# EasyEDA Pro project OpenThermEth.eprj

# Schematic OpenThermEth
Board Name: OpenThermEth; Create Date: 2024-12-09; Page Name: OpenThermEth; Project Name: OpenThermEth; Schematic Name: OpenThermEth; Update Date: 2024-12-20; Company: EasyEDA.com; Drawn: EasyEDA; Page Size: A4; Part Number: JLCPCB-002; Reviewed: EasyEDA; Version: V0.1
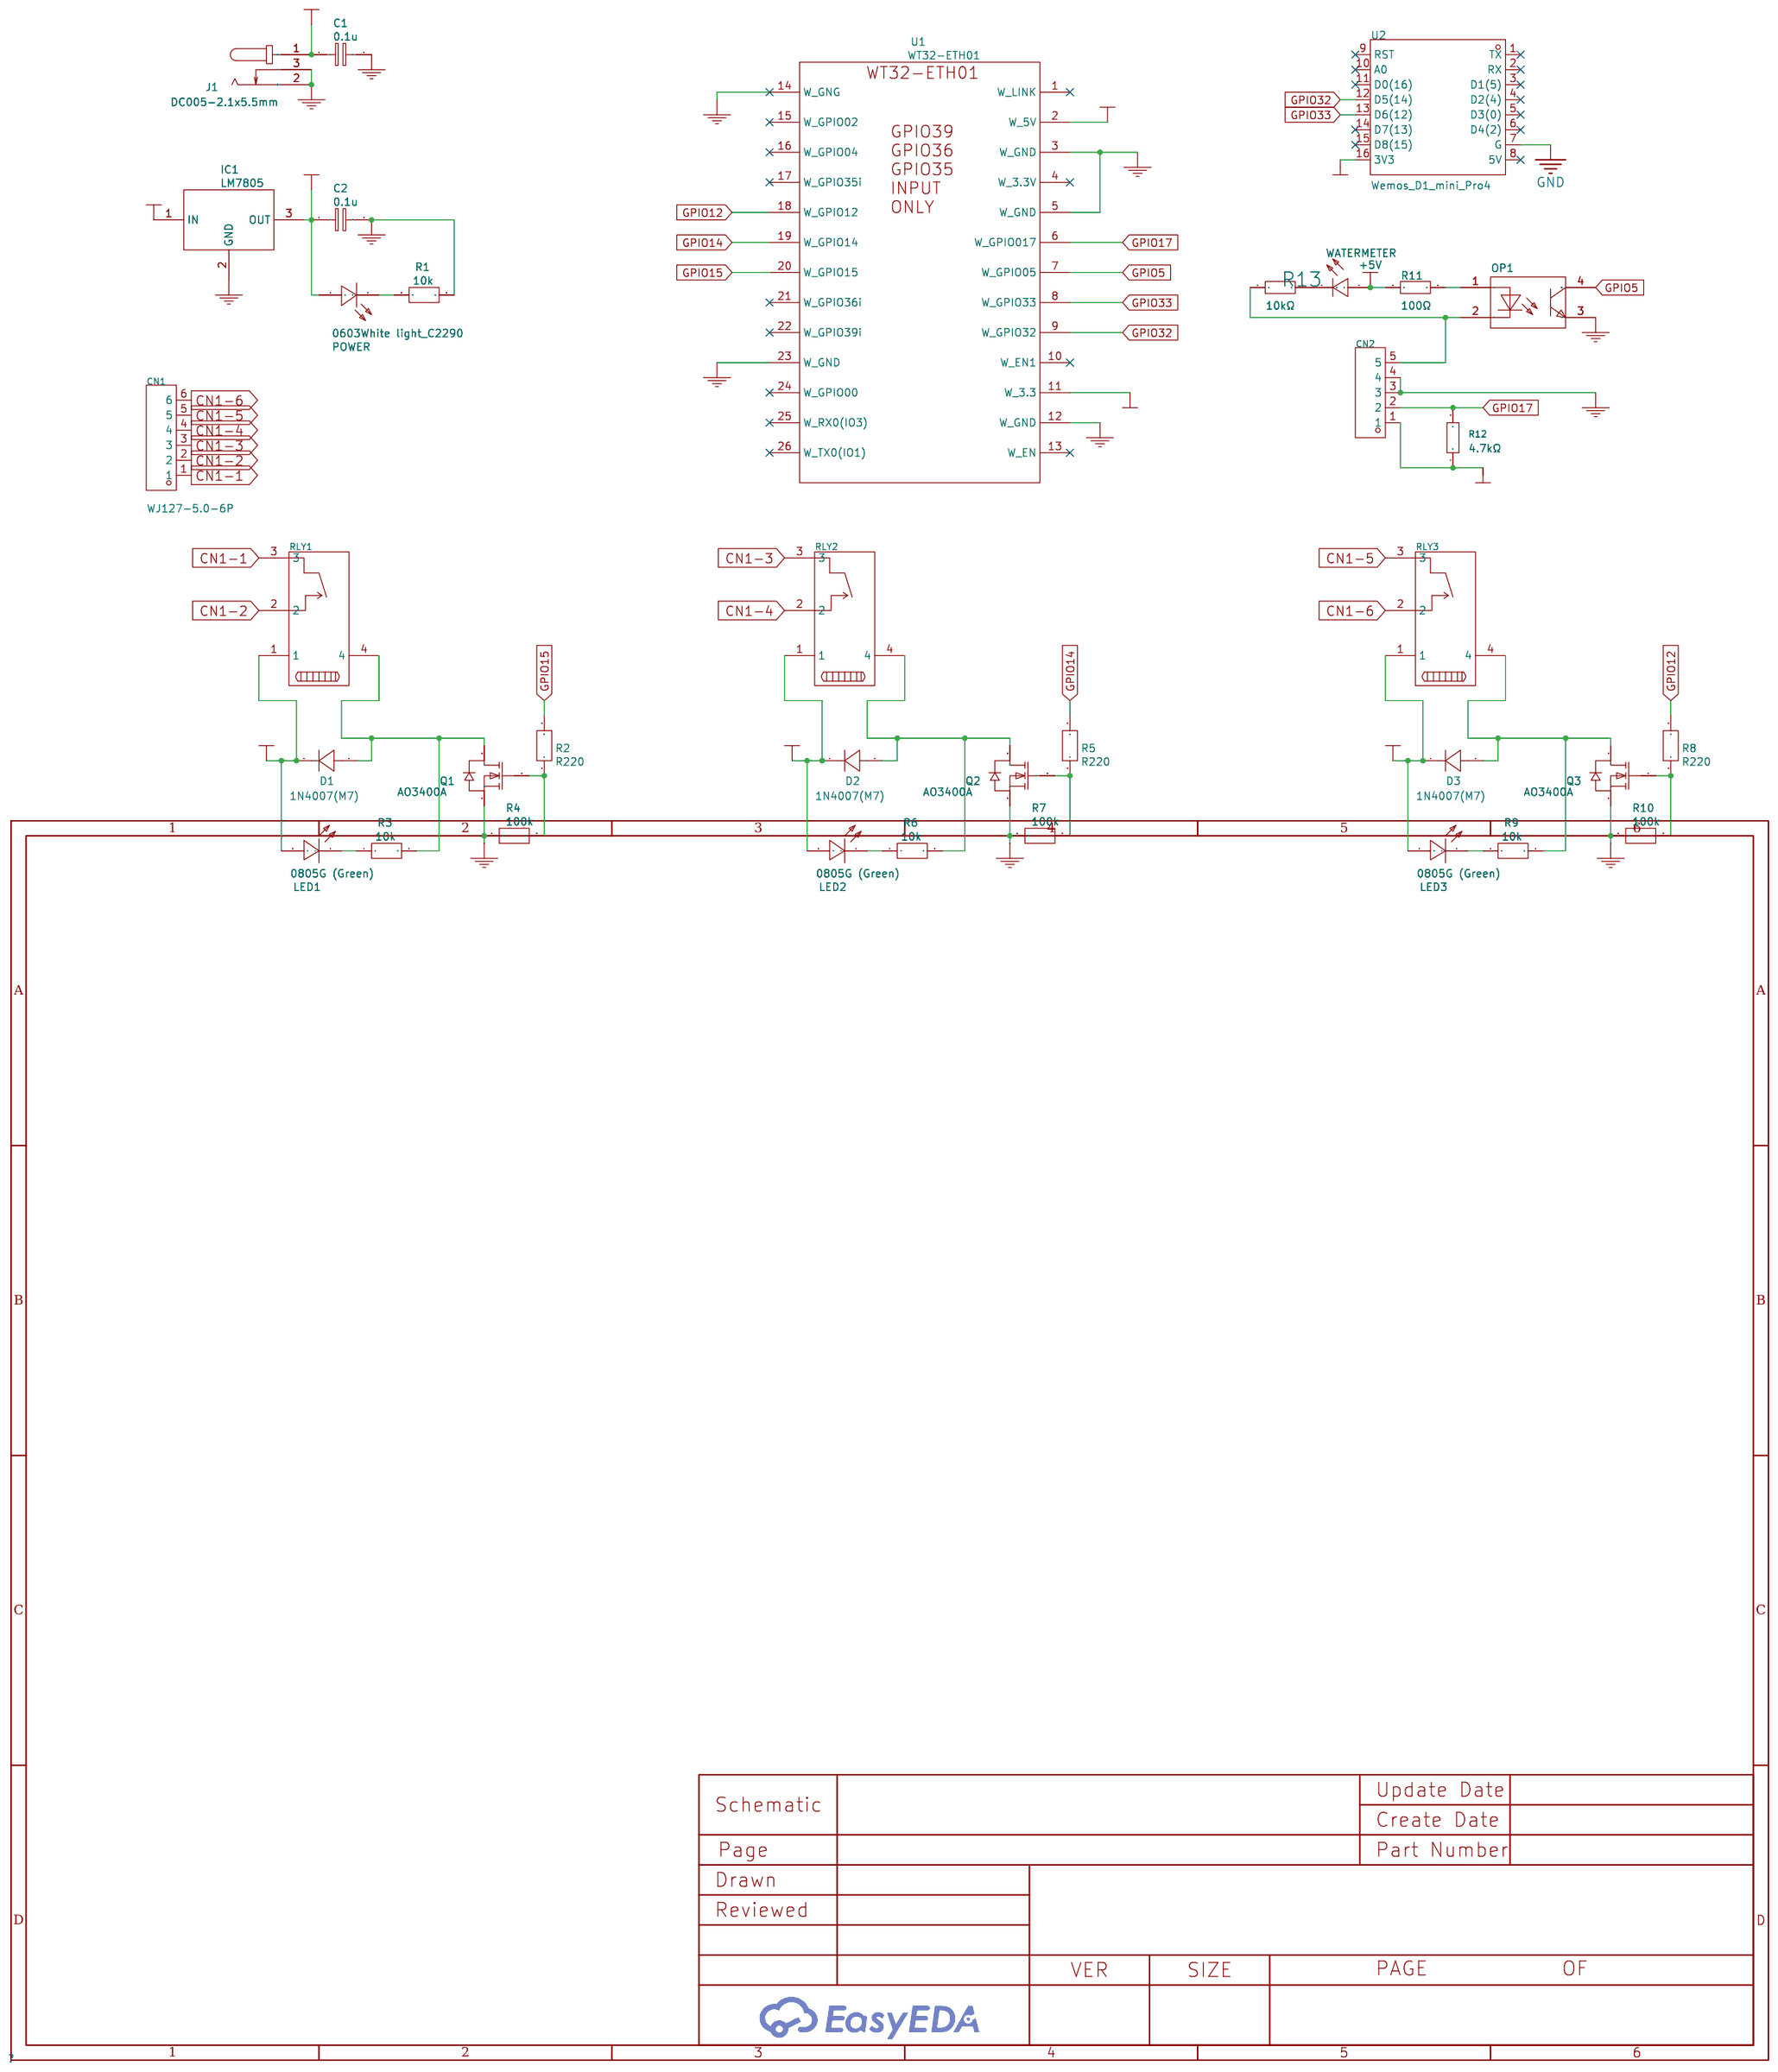
[diagram p0: schematic sheet]

## Parts
C1  0.1u  [C0603]
C2  0.1u  [C0603]
CN1  WJ127-5.0-6P  [CONN-TH_6P-P5.00_WJ127-5.0-6P]  (no BOM)
CN2  WJ127-5.0-5P  [CONN-TH_5P-P5.00_WJ127-5.0-5P]  (no BOM)
D1  1N4007(M7)  [SMA_L4.3-W2.7-LS5.1-RD]
D2  1N4007(M7)  [SMA_L4.3-W2.7-LS5.1-RD]
D3  1N4007(M7)  [SMA_L4.3-W2.7-LS5.1-RD]
IC1  LM7805  [LM7805]  (no BOM)
J1  DC005-2.1x5.5mm  [DC-IN-TH_POWER-JACK]  (no BOM)
LED1  0805G (Green)  [LED0805-RD_GREEN]
LED2  0805G (Green)  [LED0805-RD_GREEN]
LED3  0805G (Green)  [LED0805-RD_GREEN]
OP1  EL817S1(C)(TU)-F  [OPTO-SMD-4_L4.6-W6.5-P2.54-LS10.3-TL]
POWER  0603White light_C2290  [LED0603-R-RD_WHITE]
Q1  AO3400A  [SOT-23-3_L2.9-W1.6-P1.90-LS2.8-BR]
Q2  AO3400A  [SOT-23-3_L2.9-W1.6-P1.90-LS2.8-BR]
Q3  AO3400A  [SOT-23-3_L2.9-W1.6-P1.90-LS2.8-BR]
R1  10k  [R0603]
R2  R220  [R0603]
R3  10k  [R0603]
R4  100k  [R0603]
R5  R220  [R0603]
R6  10k  [R0603]
R7  100k  [R0603]
R8  R220  [R0603]
R9  10k  [R0603]
R10  100k  [R0603]
R11  100Ω  [R0805]
R12  4.7kΩ  [R0805]
R13  10kΩ  [R0603]
RLY1  G5NB-1A-E-DC5V  [RELAY-TH_G5NB-1A-E-DCXX]  (no BOM)
RLY2  G5NB-1A-E-DC5V  [RELAY-TH_G5NB-1A-E-DCXX]  (no BOM)
RLY3  G5NB-1A-E-DC5V  [RELAY-TH_G5NB-1A-E-DCXX]  (no BOM)
U1  WT32-ETH01  [WT32-ETH01-M]  (no BOM)
U2  Wemos_D1_mini_Pro4  [DIP-16_WEMOS_D1_MINI_PRO4]  (no BOM)
WATERMETER  19-213/Y2C-CQ2R2L/3T(CY)  [LED0603-RD-YELLOW]

## Library data of the parts
C1 C2 = 0.1u: Supplier Part: C1525; Supplier: LCSC; Manufacturer Part: CL05B104KO5NNNC; Manufacturer: SAMSUNG(三星)
CN1 = WJ127-5.0-6P: LCSC Part Name: 5mm 1x6P 排数:1 每排P数:6 直插; Supplier Part: C192781; Manufacturer: KANGNEX(康奈克斯电气); Supplier Footprint: 插件,P=5mm; JLCPCB Part Class: Extended Part; Datasheet: https://atta.szlcsc.com/upload/public/pdf/source/20191225/C192781_B56A6C480C3F3CBA75DCAA22912D9BEF.pdf; Supplier: LCSC; Structure: 1x6P; Pitch: 5mm; Color: Green; Mounting Style: Straight; Current Rating (Max): 15A; Voltage Rating (Max): 250V; Number of Pins: 6P; Number of Rows: 1; Wire Gauge - AWG: 14~26; Wire Gauge - mm2: 1.5; Number of PINs Per Row: 6; Operating Temperature Range: -40℃~+105℃
CN2 = WJ127-5.0-5P_C192780: LCSC Part Name: 5mm 1x5P 排数:1 每排P数:5 直插; Supplier Part: C192780; Manufacturer: KANGNEX(康奈克斯电气); Supplier Footprint: 插件,P=5mm; JLCPCB Part Class: Extended Part; Datasheet: https://atta.szlcsc.com/upload/public/pdf/source/20191225/C192780_FD0BDD0A5D81BC1DDFC4E04964283CC7.pdf; Supplier: LCSC; Structure: 1x5P; Pitch: 5mm; Color: Green; Mounting Style: Straight; Current Rating (Max): 15A; Voltage Rating (Max): 250V; Number of Pins: 5P; Number of Rows: 1; Wire Gauge - AWG: 14~26; Wire Gauge - mm2: 1.5; Number of PINs Per Row: 5; Operating Temperature Range: -40℃~+105℃
D1-D3 = 1N4007(M7): Supplier: LCSC; Supplier Part: C2988638; Manufacturer: UMW(友台半导体); JLCPCB Part Class: Extended Part
IC1 = LM7805: sim: true
J1 = DC005-2.1x5.5mm: Supplier: LCSC; Supplier Part: C9900001795; Manufacturer: 索峰; Manufacturer Part: POWER-JACK; JLCPCB Part Class: Extended Part
LED1-LED3 = 0805G (Green): Supplier: LCSC; Manufacturer: KENTO; Supplier Part: C2297; JLCPCB Part Class: Basic Part
OP1 = EL817S1(C)(TU)-F: Supplier: LCSC; Manufacturer: EVERLIGHT(亿光); Supplier Part: C106900; JLCPCB Part Class: Basic Part
POWER = 0603White light_C2290: Supplier: LCSC; Manufacturer: KENTO; Manufacturer Part: KT-0603W; Supplier Part: C2290; JLCPCB Part Class: Basic Part
Q1-Q3 = AO3400A: Supplier: LCSC; Manufacturer: AOS; Supplier Part: C20917; JLCPCB Part Class: Basic Part
R1 R3 R6 R9 = 10k: Supplier Part: C25804; Supplier: LCSC; Manufacturer Part: 0603WAF1002T5E; Manufacturer: UNI-ROYAL(厚声)
R2 R5 R8 = R220: Supplier Part: C22962; Supplier: LCSC; Manufacturer Part: 0603WAF2200T5E; Manufacturer: UNI-ROYAL(厚声)
R4 R7 R10 = 100k: Supplier Part: C25803; Supplier: LCSC; Manufacturer Part: 0603WAF1003T5E; Manufacturer: UNI-ROYAL(厚声)
R11 = 0805W8F1000T5E_C17408: LCSC Part Name: 100Ω ±1% 125mW 厚膜电阻; Supplier Part: C17408; Manufacturer: UNI-ROYAL(厚声); Manufacturer Part: 0805W8F1000T5E; Supplier Footprint: 0805; JLCPCB Part Class: Basic Part; Datasheet: https://atta.szlcsc.com/upload/public/pdf/source/20200306/C422600_1E6D84923E4A46A82E41ADD87F860B5C.pdf; Supplier: LCSC; Type: Thick Film Resistors; Tolerance: ±1%; Temperature Coefficient: ±100ppm/℃; Operating Temperature Range: -55℃~+155℃
R12 = 0805W8F4701T5E: LCSC Part Name: 4.7kΩ ±1% 125mW 厚膜电阻; Supplier Part: C17673; Manufacturer: UNI-ROYAL(厚声); Supplier Footprint: 0805; JLCPCB Part Class: Basic Part; Datasheet: https://atta.szlcsc.com/upload/public/pdf/source/20200306/C422600_1E6D84923E4A46A82E41ADD87F860B5C.pdf; Supplier: LCSC; Type: Thick Film Resistors; Tolerance: ±1%; Temperature Coefficient: ±100ppm/℃; Operating Temperature Range: -55℃~+155℃
R13 = 0603WAF1002T5E: LCSC Part Name: 厚膜电阻 10kΩ ±1% 100mW; Supplier Part: C25804; Manufacturer: UNI-ROYAL(厚声); Supplier Footprint: 0603; JLCPCB Part Class: Basic Part; Datasheet: https://atta.szlcsc.com/upload/public/pdf/source/20200306/C422600_1E6D84923E4A46A82E41ADD87F860B5C.pdf; Supplier: LCSC; Type: Thick Film Resistors; Tolerance: ±1%; Temperature Coefficient: ±100ppm/℃; Operating Temperature Range: -55℃~+155℃
RLY1-RLY3 = G5NB-1A-E-DC5V: Supplier Part: C48746; Manufacturer: OMRON(欧姆龙); Supplier Footprint: 插件,7x20.4mm; JLCPCB Part Class: Extended Part; Supplier: LCSC
U1 = WT32-ETH01: Manufacturer: Wireless-Tag; link: http://www.wireless-tag.com/wp-content/uploads/2020/08/WT32-ETH01规格书V1.2EN（英文）.pdf
U2 = Wemos_D1_mini_Pro4: Supplier Part: C2837266; Supplier Footprint: DIP-16; Supplier: LCSC
WATERMETER = 19-213/Y2C-CQ2R2L/3T(CY): LCSC Part Name: 黄灯; Supplier Part: C72038; Manufacturer: EVERLIGHT(亿光); Supplier Footprint: 0603; JLCPCB Part Class: Basic Part; Datasheet: https://atta.szlcsc.com/upload/public/pdf/source/20160507/1462613613586.pdf; Supplier: LCSC; Emitted Color: Yellow; Power Dissipation: 60mW; Forward Current: 20mA; Dominant Wavelength: 585.5nm~591.5nm; Peak Wavelength: 591nm; Lens Color: 无色透明透镜; Viewing Angle: 120°; Operating Temperature: -40℃~+85℃

## Nets
+3.3V: CN2.1 R12.1 U1.11(W_3.3) U2.16(3V3)
+5V: C2.1 D1.1(K) D2.1(K) D3.1(K) IC1.3(OUT) LED1.2(A) LED2.2(A) LED3.2(A) POWER.1(A) R11.1 RLY1.1 RLY2.1 RLY3.1 U1.2(W_5V) WATERMETER.2(A)
GND: C1.2 C2.2 CN2.3 CN2.4 IC1.2(GND) J1.2(GND) J1.3 OP1.3(EM) Q1.2(S) Q2.2(S) Q3.2(S) R1.2 R4.1 R7.1 R10.1 U1.3(W_GND) U1.5(W_GND) U1.12(W_GND) U1.14(W_GNG) U1.23(W_GND) U2.7(G)
VCC: C1.1 IC1.1(IN) J1.1(VCC)
CN1-1: CN1.1 RLY1.3
CN1-2: CN1.2 RLY1.2
CN1-3: CN1.3 RLY2.3
CN1-4: CN1.4 RLY2.2
CN1-5: CN1.5 RLY3.3
CN1-6: CN1.6 RLY3.2
GPIO5: OP1.4(COL) U1.7(W_GPIO05)
GPIO12: R8.2 U1.18(W_GPIO12)
GPIO14: R5.2 U1.19(W_GPIO14)
GPIO15: R2.2 U1.20(W_GPIO15)
GPIO17: CN2.2 R12.2 U1.6(W_GPIO017)
GPIO32: U1.9(W_GPIO32) U2.12(D5(14))
GPIO33: U1.8(W_GPIO33) U2.13(D6(12))
$1N3: D1.2(A) Q1.3(D) R3.2 RLY1.4
$1N5: Q1.1(G) R2.1 R4.2
$1N15: LED1.1(K) R3.1
$1N16: POWER.2(K) R1.1
$1N14239: D2.2(A) Q2.3(D) R6.2 RLY2.4
$1N14251: LED2.1(K) R6.1
$1N14257: Q2.1(G) R5.1 R7.2
$1N14805: D3.2(A) Q3.3(D) R9.2 RLY3.4
$1N14817: LED3.1(K) R9.1
$1N14823: Q3.1(G) R8.1 R10.2
$1N15278: OP1.1(AN) R11.2
$1N15297: CN2.5 OP1.2(CAT) R13.1
Net-(R13-2): R13.2 WATERMETER.1(C)

Not connected (* = marked no-connect by the designer): U1 1(W_LINK)* 4(W_3.3V)* 10(W_EN1)* 13(W_EN)* 15(W_GPIO02)* 16(W_GPIO04)* 17(W_GPIO35i)* 21(W_GPIO36i)* 22(W_GPIO39i)* 24(W_GPIO00)* 25(W_RX0(IO3))* 26(W_TX0(IO1))*; U2 1(TX)* 2(RX)* 3(D1(5))* 4(D2(4))* 5(D3(0))* 6(D4(2))* 8(5V)* 9(RST)* 10(A0)* 11(D0(16))* 14(D7(13))* 15(D8(15))*

# Board OpenThermEth
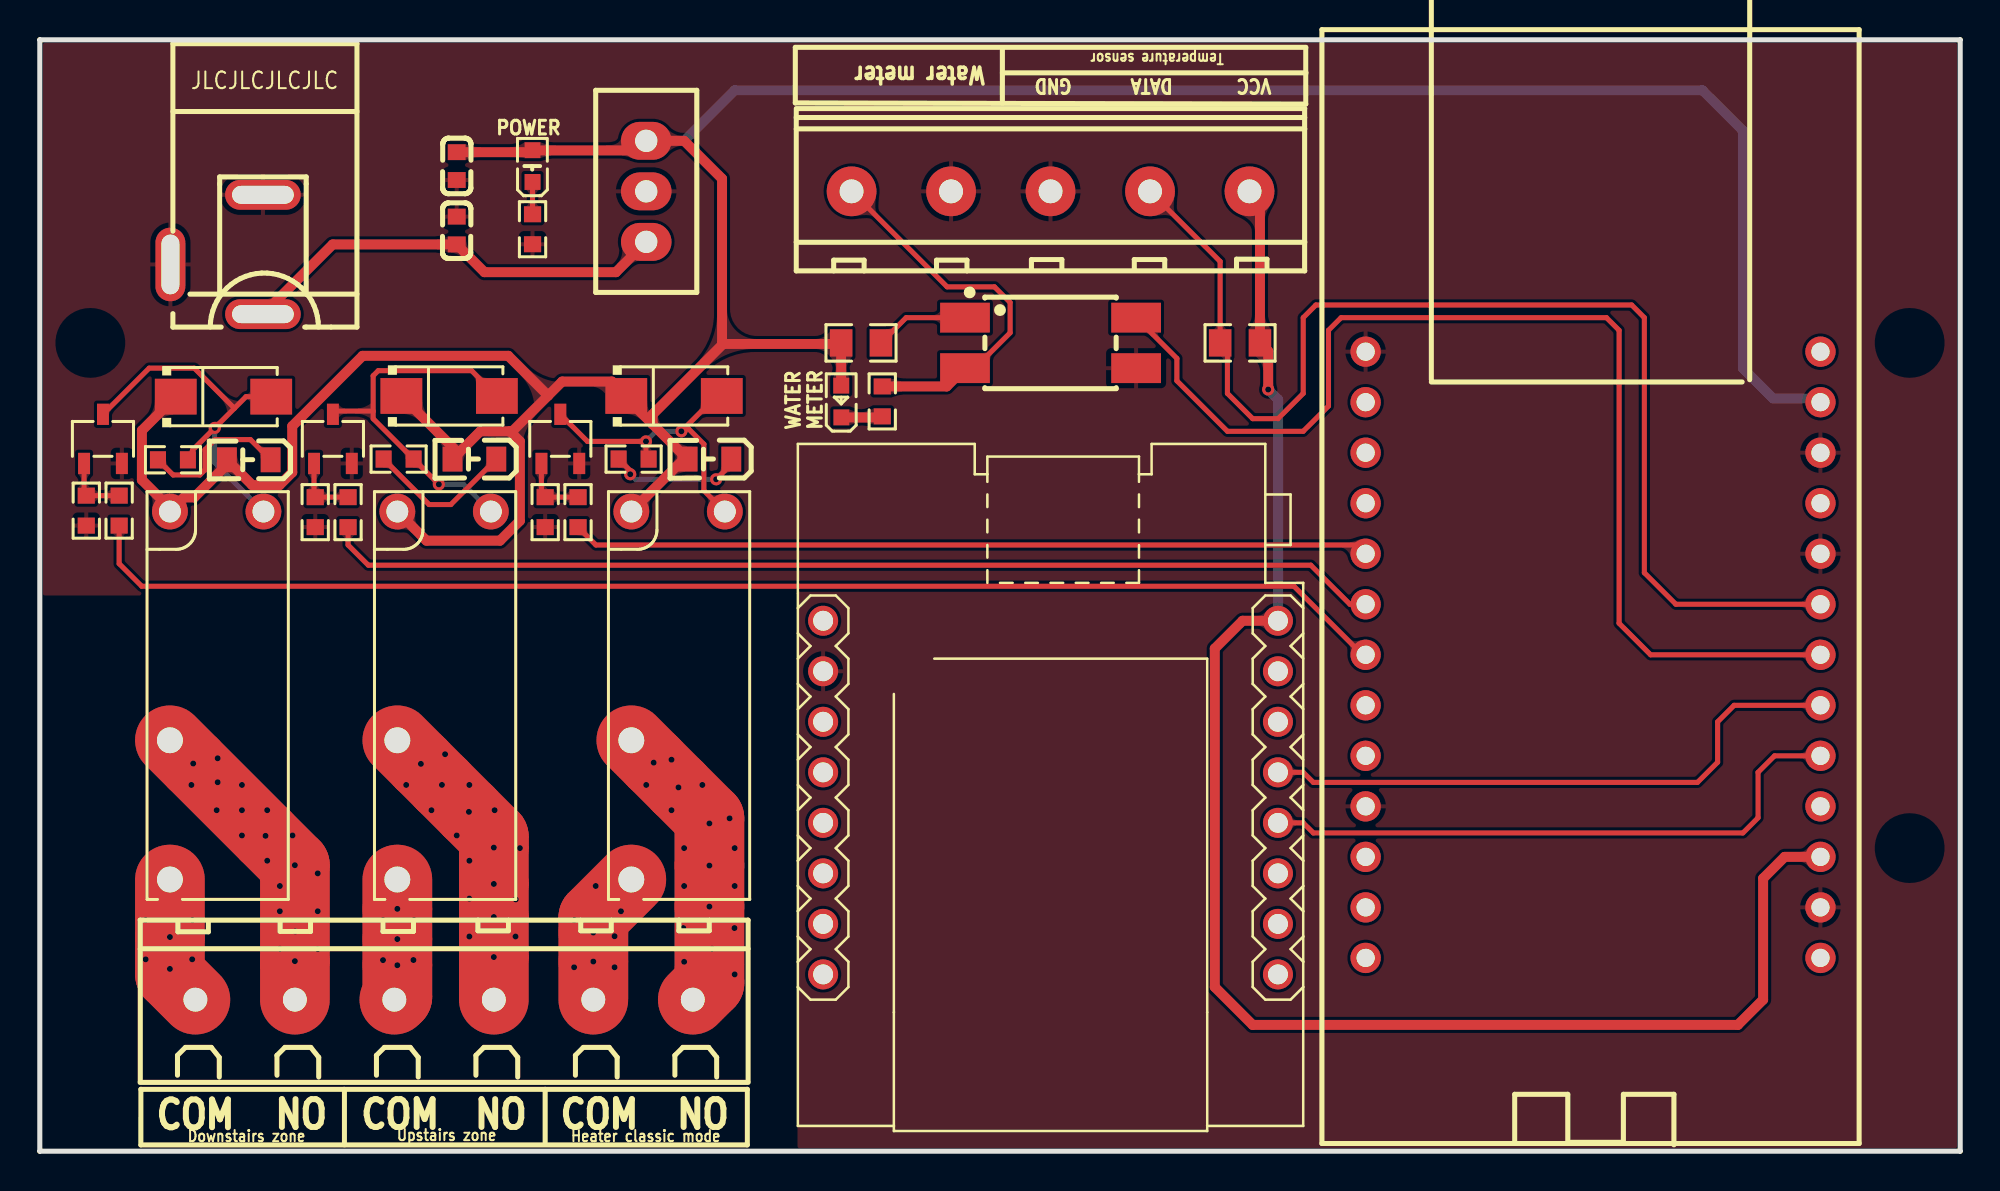
[diagram p1: board, top side]
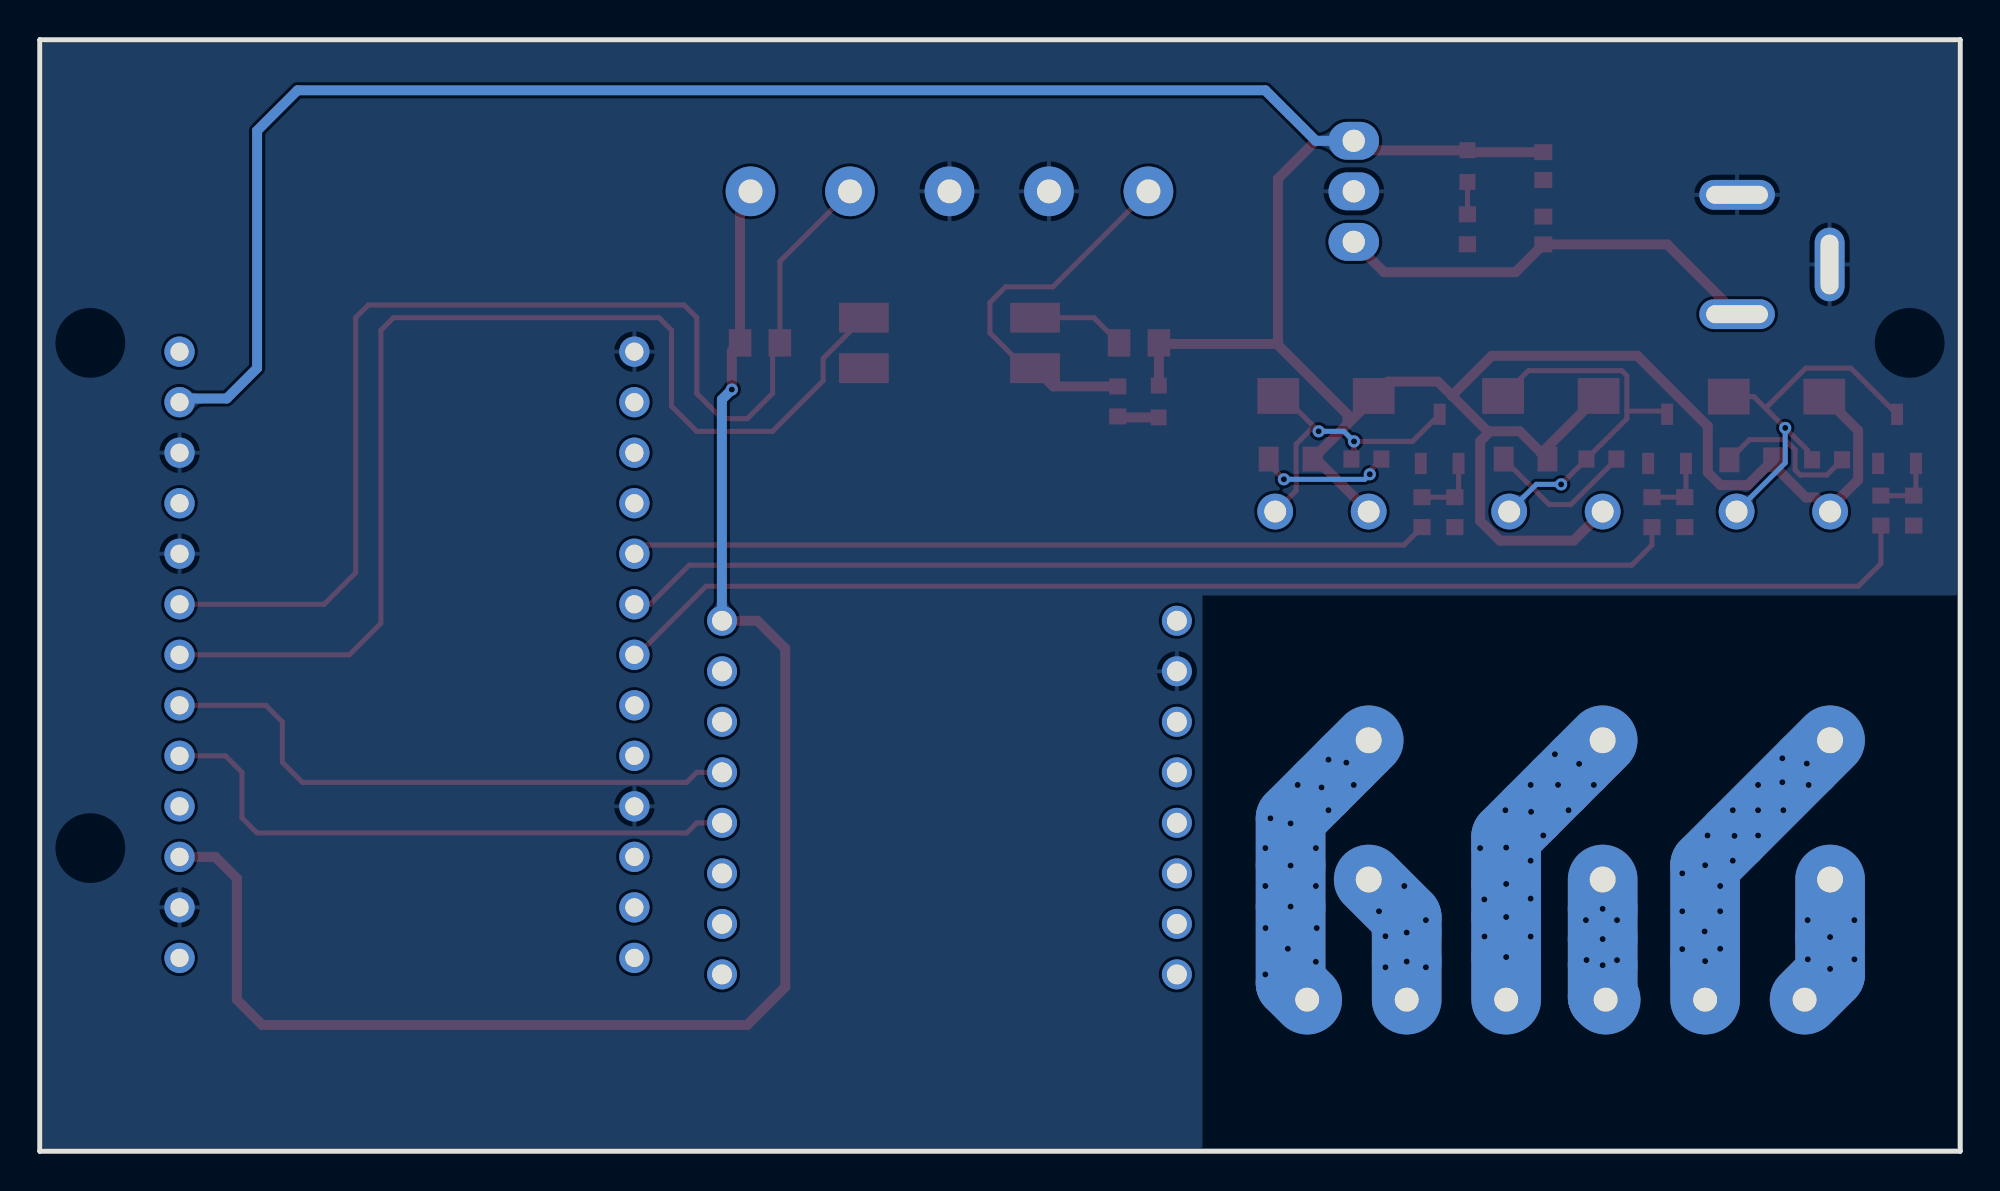
[diagram p2: board, bottom side, seen from below]

Outline 96.52 x 55.88 mm; copper layers: Top Layer, Bottom Layer. Coordinates in mm from the lower left corner of the outline.
Outline path: 0,55.88 96.52,55.88 96.52,0 0,0 0,55.88
Stack: Top Layer 0.035mm / Dielectric1 1.51mm FR4 er 4.5 / Bottom Layer 0.035mm

## Design rules (mm)
template: User Custom Config
spacing Default (default): track to track 0.152, other pairs 0 to 0.152
track width Default (default): min 0.254, default 0.254, max 25.4
track width 0.5mm: min 0.5, default 0.5, max 2.54
differential pair differentialPair (default): width min 0.127, default 0.254, max 2.54; gap min 0.152, default 0.152
via Default (default): diameter min 0.61, default 0.61, max 100.025; hole min 0.305, default 0.305, max 59.995
net +5V uses 0.5mm
net VCC uses 0.5mm
net +3.3V uses 0.5mm

## Placement (name value [footprint] x y rotation side)
C1  0.1u  [C0603]  20.95 46.29 90 top
C2  0.1u  [C0603]  20.95 49.53 270 top
CN1  WJ127-5.0-6P  [CONN-TH_6P-P5.00_WJ127-5.0-6P]  20.32 7.62 0 top
CN2  WJ127-5.0-5P  [CONN-TH_5P-P5.00_WJ127-5.0-5P]  50.8 48.26 180 top
D1  1N4007(M7)  [SMA_L4.3-W2.7-LS5.1-RD]  9.23 37.94 0 top
D2  1N4007(M7)  [SMA_L4.3-W2.7-LS5.1-RD]  20.57 37.97 0 top
D3  1N4007(M7)  [SMA_L4.3-W2.7-LS5.1-RD]  31.88 37.97 0 top
IC1  -  [LM7805]  30.48 48.26 90 top
J1  DC005-2.1x5.5mm  [DC-IN-TH_POWER-JACK]  8.89 45.08 270 top
LED1  0805G (Green)  [LED0805-RD_GREEN]  10.5 34.76 0 top
LED2  0805G (Green)  [LED0805-RD_GREEN]  21.84 34.8 0 top
LED3  0805G (Green)  [LED0805-RD_GREEN]  33.66 34.8 0 top
OP1  EL817S1(C)(TU)-F  [OPTO-SMD-4_L4.6-W6.5-P2.54-LS10.3-TL]  50.8 40.64 0 top
POWER  0603White light_C2290  [LED0603-R-RD_WHITE]  24.77 49.53 90 top
Q1  AO3400A  [SOT-23-3_L2.9-W1.6-P1.90-LS2.8-BR]  3.17 35.81 90 top
Q2  AO3400A  [SOT-23-3_L2.9-W1.6-P1.90-LS2.8-BR]  14.73 35.81 90 top
Q3  AO3400A  [SOT-23-3_L2.9-W1.6-P1.90-LS2.8-BR]  26.16 35.81 90 top
R1  10k  [R0603]  24.77 46.36 270 top
R2  R220  [R0603]  3.99 32.21 270 top
R3  10k  [R0603]  6.69 34.76 0 top
R4  100k  [R0603]  2.34 32.21 90 top
R5  R220  [R0603]  15.49 32.13 270 top
R6  10k  [R0603]  18.03 34.8 0 top
R7  100k  [R0603]  13.84 32.13 90 top
R8  R220  [R0603]  27.05 32.13 270 top
R9  10k  [R0603]  29.84 34.8 0 top
R10  100k  [R0603]  25.4 32.13 90 top
R11  100Ω  [R0805]  41.28 40.64 0 top
R12  4.7kΩ  [R0805]  60.32 40.64 180 top
R13  10kΩ  [R0603]  42.34 37.7 270 top
RLY1  G5NB-1A-E-DC5V  [RELAY-TH_G5NB-1A-E-DCXX]  8.89 22.91 270 top
RLY2  G5NB-1A-E-DC5V  [RELAY-TH_G5NB-1A-E-DCXX]  20.32 22.91 270 top
RLY3  G5NB-1A-E-DC5V  [RELAY-TH_G5NB-1A-E-DCXX]  32.08 22.91 270 top
U1  WT32-ETH01  [WT32-ETH01-M]  77.47 26.67 270 top
U2  Wemos_D1_mini_Pro4  [DIP-16_WEMOS_D1_MINI_PRO4]  50.8 17.78 180 top
WATER
METER  -  [LED0603-RD-YELLOW]  40.28 37.69 90 top

## Footprints (pads in the part's own frame, mm; a bottom-side part is the same pattern mirrored in y, then rotated)
C0603
  rect 0.8x0.9 smd: 1(-0.7,0) 2(0.7,0)
CONN-TH_5P-P5.00_WJ127-5.0-5P
  round 2.5 hole 1.2: 1(-10,0) 2(-5,0) 3(0,0) 4(5,0) 5(10,0)
CONN-TH_6P-P5.00_WJ127-5.0-6P
  round 2.5 hole 1.2: 1(-12.5,0) 2(-7.5,0) 3(-2.5,0) 4(2.5,0) 5(7.5,0) 6(12.5,0)
DC-IN-TH_POWER-JACK
  oval 1.5x3.8 hole 0.9x3.1: 1(3,2.325) 2(-2.999,2.325)
  oval 3.7x1.5 hole 3x0.9: 3(0.5,-2.325)
DIP-16_WEMOS_D1_MINI_PRO4
  round 1.508 hole 1x1: 1(11.43,8.89) 2(11.43,6.35) 3(11.43,3.81) 4(11.43,1.27) 5(11.43,-1.27) 6(11.43,-3.81) 7(11.43,-6.35) 8(11.43,-8.89) 9(-11.43,8.89) 10(-11.43,6.35) 11(-11.43,3.81) 12(-11.43,1.27) 13(-11.43,-1.27) 14(-11.43,-3.81) 15(-11.43,-6.35) 16(-11.43,-8.89)
LED0603-R-RD_WHITE
  rect 0.8x0.8 smd: 1(0.8,0) 2(-0.8,0)
LED0603-RD-YELLOW
  rect 0.8x0.8 smd: 1(-0.799,-0.004) 2(0.799,0.004)
LED0805-RD_GREEN
  rect 1x1.25 smd: 1(1.1,0) 2(-1.099,0)
LM7805
  oval 1.905x2.54 hole 1.117: 1(-2.54,0) 2(0,0) 3(2.54,0)
OPTO-SMD-4_L4.6-W6.5-P2.54-LS10.3-TL
  rect 2.5x1.5 smd: 1(-4.3,1.27) 2(-4.3,-1.27) 3(4.3,-1.27) 4(4.3,1.27)
R0603
  rect 0.806x0.864 smd: 1(-0.753,0) 2(0.753,0)
R0805
  rect 1.133x1.377 smd: 1(-1,0) 2(1,0)
RELAY-TH_G5NB-1A-E-DCXX
  round 1.8 hole 1.1: 1(-9.25,-2.35) 4(-9.25,2.35)
  round 2 hole 1.3: 2(2.25,-2.35) 3(9.25,-2.35)
SMA_L4.3-W2.7-LS5.1-RD
  rect 2.1x1.8 smd: 1(-2.4,0) 2(2.4,0)
SOT-23-3_L2.9-W1.6-P1.90-LS2.8-BR
  rect 1.07x0.6 smd: 1(-1.235,0.95) 2(-1.235,-0.95) 3(1.236,0)
WT32-ETH01-M
  round 1.524 hole 0.914: 1(-13.529,12.027) 2(-10.989,12.027) 3(-8.449,12.027) 4(-5.909,12.027) 5(-3.369,12.027) 6(-0.829,12.027) 7(1.711,12.027) 8(4.251,12.027) 9(6.791,12.027) 10(9.331,12.027) 11(11.871,12.027) 12(14.411,12.027) 13(16.951,12.027) 14(-13.529,-10.833) 15(-10.989,-10.833) 16(-8.449,-10.833) 17(-5.909,-10.833) 18(-3.369,-10.833) 19(-0.829,-10.833) 20(1.711,-10.833) 21(4.251,-10.833) 22(6.791,-10.833) 23(9.331,-10.833) 24(11.871,-10.833) 25(14.411,-10.833) 26(16.951,-10.833)

## Nets
As in the schematic, except:
+5V: C2.1 D1.1 D2.1 D3.1 IC1.3 LED1.2 LED2.2 LED3.2 POWER.1 R11.1 RLY1.1 RLY2.1 RLY3.1 U1.2 WATER
METER.2
$1N21025: R13.2 WATER
METER.1

Pads without a net: U1 1 4 10 13 15 16 17 21 22 24 25 26; U2 1 2 3 4 5 6 8 9 10 11 14 15

## Via types
v1: diameter 0.61, hole 0.305, Top Layer to Bottom Layer, 87 vias

## Routing (per net, layer and track width the routed paths; a pad name or vN(x,y) marks a point on that pad's centre or on a via; arc(x,y) is an arc through that point)
+3.3V: length 81.3
  Top Layer w0.5: U2.16 60.45,26.67 59.06,25.27 59.06,8.25 60.96,6.35 85.34,6.35 86.61,7.62 86.61,13.72 87.7,14.8 U1.11 ; CN2.1 61.32,47.73 R12.1 61.74,40.23 v1(61.74,38.3)
  Bottom Layer w0.5: v1(61.74,38.3) 62.24,37.8 62.24,26.66 U2.16
+5V: length 177.5
  Top Layer w0.5: 34.34,40.59 30.8,37.05 30.8,36.55 ; 34.34,40.59 34.29,40.63 34.29,48.89 32.38,50.8 IC1.3 30,50.32 24.75,50.32 ; 34.34,40.59 40.22,40.59 R11.1 40.28,38.5 WATER
METER.2 ; 21.08,35.14 21.01,35.14 D2.1 ; 21.08,35.14 LED2.2 ; 21.08,35.14 22.14,36.2 23.63,36.2 ; 24.75,50.32 24.67,50.23 C2.1 ; 24.75,50.32 POWER.1 ; 30.8,36.55 32.31,35.05 ; 30.8,36.55 29.48,37.88 D3.1 28.75,38.7 26.25,38.7 25.55,37.99 ; 32.31,35.05 LED3.2 ; 32.31,35.05 32.31,34.74 RLY3.1 ; 6.63,32.25 7.25,32.87 7.76,32.87 9.53,34.64 ; 6.63,32.25 5.13,33.75 5.13,36.24 D1.1 ; 6.63,32.25 RLY1.1 ; 25.55,37.99 23.75,36.2 23.63,36.2 ; 25.55,37.99 23.55,39.99 16.22,39.99 12.69,36.45 12.69,34.13 12.05,33.49 10.68,33.49 9.53,34.64 ; 9.53,34.64 LED1.2 ; 23.63,36.2 24.13,35.7 24.13,31.7 23.13,30.7 19.43,30.7 RLY2.1
  Bottom Layer w0.5: IC1.3 32.38,50.8 34.93,53.34 83.57,53.34 85.6,51.31 85.6,39.37 87.12,37.85 89.31,37.85 U1.2
VCC: length 21.9
  Top Layer w0.5: J1.1 14.72,45.59 C1.1 22.35,44.2 28.96,44.2 IC1.1
CN1-1: length 13.1
  Top Layer w3.5: RLY1.3 v1(6.54,10.77) 6.54,8.9 CN1.1
  Bottom Layer w3.5: RLY1.3 v1(6.54,10.77) 6.54,8.9 CN1.1
  vias: v1(5.32,11.62) v1(5.32,9.65) v1(6.54,9.17) v1(7.67,11.62) v1(7.66,9.65)
CN1-2: length 31.3
  Top Layer w3.5: CN1.2 v1(12.82,9.56) v1(12.82,14.38) v1(11.34,15.86) v1(7.71,19.49) RLY1.2
  Bottom Layer w3.5: CN1.2 v1(12.82,9.56) v1(12.82,14.38) v1(11.34,15.86) v1(7.71,19.49) RLY1.2
  vias: v1(7.62,18.42) v1(8.94,19.76) v1(8.94,18.55) v1(8.89,17.14) v1(10.16,18.42) v1(10.16,17.14) v1(10.16,15.88) v1(11.43,17.14) v1(11.43,14.61) v1(12.06,13.33) v1(12.06,12.06) v1(12.06,10.18) v1(12.7,15.88) v1(12.85,11.05) v1(13.97,13.97) v1(13.97,12.06) v1(13.97,10.16)
CN1-3: length 12.2
  Top Layer w3.5: RLY2.3 v1(17.97,12.19) v1(17.97,10.67) v1(17.97,9.35) 17.97,7.77 CN1.3
  Bottom Layer w3.5: RLY2.3 v1(17.97,12.19) v1(17.97,10.67) v1(17.97,9.35) 17.97,7.77 CN1.3
  vias: v1(17.25,11.62) v1(17.25,9.61) v1(18.81,11.62) v1(18.78,9.61)
CN1-4: length 30.1
  Top Layer w3.5: RLY2.2 v1(19.15,19.48) v1(20.21,18.42) v1(21.57,17.06) 22.82,15.81 v1(22.82,15.27) v1(22.82,13.44) v1(22.82,11.77) v1(22.82,9.76) CN1.4
  Bottom Layer w3.5: RLY2.2 v1(19.15,19.48) v1(20.21,18.42) v1(21.57,17.06) 22.82,15.81 v1(22.82,15.27) v1(22.82,13.44) v1(22.82,11.77) v1(22.82,9.76) CN1.4
  vias: v1(18.42,18.42) v1(19.69,17.14) v1(20.37,19.96) v1(20.95,15.88) v1(21.59,18.42) v1(21.59,14.61) v1(21.59,12.7) v1(21.59,10.8) v1(22.86,17.14) v1(23.92,12.66) v1(23.91,10.8) v1(24.13,15.24)
CN1-5: length 13.7
  Top Layer w3.5: RLY3.3 27.82,11.75 v1(27.82,10.99) v1(27.82,9.54) CN1.5
  Bottom Layer w3.5: CN1.5 v1(27.82,9.54) v1(27.82,10.99) 27.82,11.75 RLY3.3
  vias: v1(26.86,11.62) v1(26.86,9.25) v1(27.94,13.33) v1(28.89,10.81) v1(28.89,9.25) v1(29.21,12.06)
CN1-6: length 30
  Top Layer w3.5: CN1.6 33.66,8.45 v1(33.66,12.3) v1(33.66,14.36) 33.66,16.74 v1(32.1,18.29) v1(30.85,19.54) RLY3.2
  Bottom Layer w3.5: CN1.6 33.66,8.45 v1(33.66,12.3) v1(33.66,14.36) 33.66,16.74 v1(32.1,18.29) v1(30.85,19.54) RLY3.2
  vias: v1(30.48,18.42) v1(31.75,19.69) v1(31.75,17.14) v1(32.34,11.22) v1(32.38,15.24) v1(32.38,13.33) v1(32.38,9.53) v1(33.3,18.42) v1(33.66,16.48) v1(33.79,10.18) v1(34.67,16.74) v1(34.93,15.24) v1(34.93,13.33) v1(34.92,11.22) v1(34.93,8.89)
GPIO5: length 57.7
  Top Layer w0.254: U1.7 80.96,24.96 79.38,26.54 79.38,41.28 78.74,41.91 65.41,41.91 64.77,41.28 64.77,37.47 63.5,36.19 59.69,36.19 57.15,38.73 57.15,39.86 OP1.4
GPIO12: length 40.1
  Top Layer w0.254: R8.2 27.95,30.48 66.2,30.48 U1.18
GPIO14: length 53.3
  Top Layer w0.254: U1.19 65.85,27.5 63.88,29.46 16.51,29.46 15.49,30.48 R5.2
GPIO15: length 66.5
  Top Layer w0.254: U1.20 66.48,24.96 63.03,28.41 5.12,28.41 3.99,29.54 R2.2
GPIO17: length 60.4
  Top Layer w0.254: U1.6 82.23,27.5 80.65,29.08 80.65,41.91 80.01,42.55 64.13,42.55 63.5,41.91 63.5,38.1 62.23,36.83 60.96,36.83 59.69,38.1 59.69,40.28 R12.2 59.32,44.73 CN2.2
GPIO32: length 30.4
  Top Layer w0.254: U2.12 63.5,16.51 64.01,16 85.6,16 86.36,16.76 86.36,19.05 87.19,19.88 U1.9
GPIO33: length 30.3
  Top Layer w0.254: U1.8 85.16,22.42 84.33,21.59 84.33,19.56 83.31,18.54 64.01,18.54 63.5,19.05 U2.13
$1N3: length 19.3
  Top Layer w0.254: R3.2 7.67,34.99 7.67,35.24 v1(8.79,36.37) 9.78,37.35 ; 9.78,37.35 7.77,39.37 5.5,39.37 3.17,37.05 ; 9.78,37.35 10.37,37.94 D1.2
  Bottom Layer w0.254: RLY1.4 8.79,34.61 v1(8.79,36.37)
$1N5: length 3.3
  Top Layer w0.254: Q1.1 2.22,33.07 R4.2 R2.1
$1N15: length 7.7
  Top Layer w0.254: R3.1 6.7,34 8.05,34 8.3,34.25 8.3,35.27 8.81,35.78 10.59,35.78 LED1.1
$1N16: length 1.6
  Top Layer w0.254: POWER.2 R1.1
$1N14239: length 18.9
  Top Layer w0.254: 16.76,37.21 16.76,38.99 17.01,39.24 21.7,39.24 D2.2 ; 16.76,37.21 14.89,37.21 14.73,37.05 ; 16.76,37.21 16.76,36.83 R6.2 v1(20.06,33.53)
  Bottom Layer w0.254: v1(20.06,33.53) 21.3,33.53 RLY2.4
$1N14251: length 7.6
  Top Layer w0.254: R6.1 19.57,32.51 20.66,32.51 LED2.1
$1N14257: length 3.4
  Top Layer w0.254: Q2.1 13.78,32.95 R7.2 R5.1
$1N14805: length 15.7
  Top Layer w0.254: 32.36,36.31 34.02,37.97 34.28,37.97 ; 32.36,36.31 32.62,36.31 33.38,35.55 33.38,33.21 RLY3.4 ; 32.36,36.31 v1(32.25,36.19) ; Q3.3 27.52,35.69 v1(30.47,35.69) 30.47,34.93 R9.2
  Bottom Layer w0.254: v1(30.47,35.69) 30.97,36.19 v1(32.25,36.19)
$1N14817: length 6.8
  Top Layer w0.254: LED3.1 34.75,34.54 v1(33.99,33.78) ; R9.1 29.68,34.21 v1(29.68,34.04)
  Bottom Layer w0.254: v1(33.99,33.78) 29.93,33.78 v1(29.68,34.04)
$1N14823: length 3.4
  Top Layer w0.254: Q3.1 25.21,33.07 R10.2 R8.1
$1N15278: length 4.8
  Top Layer w0.254: R11.2 43.54,41.91 OP1.1
$1N15297: length 19.3
  Top Layer w0.254: OP1.2 46.99,39.37 48.77,41.15 48.77,42.67 47.98,43.46 45.6,43.46 CN2.5
  Top Layer w0.5: OP1.2 45.58,38.45 R13.1
$1N21025: length 2.1
  Top Layer w0.5: WATER
METER.1 42.29,36.89 R13.2

## Copper pours and planes (outline as drawn; the poured copper is in the pictures)
GND on Top Layer: 96.52,0 96.52,55.88 0,55.88 0,27.94 38.08,27.94 38.08,0
GND on Bottom Layer: 96.52,0 96.52,55.88 0,55.88 0,27.94 38.08,27.94 38.08,0

Small or netless copper shapes (teardrops, artwork), in the pictures only: 102 on Top Layer, 13 on Bottom Layer

## Text on the board
Top Silkscreen Layer: Temperature sensor | Downstairs zone | Upstairs zone | Heater classic mode | GND | DATA | VCC | JLCJLCJLCJLC | Water meter | COM | NO
